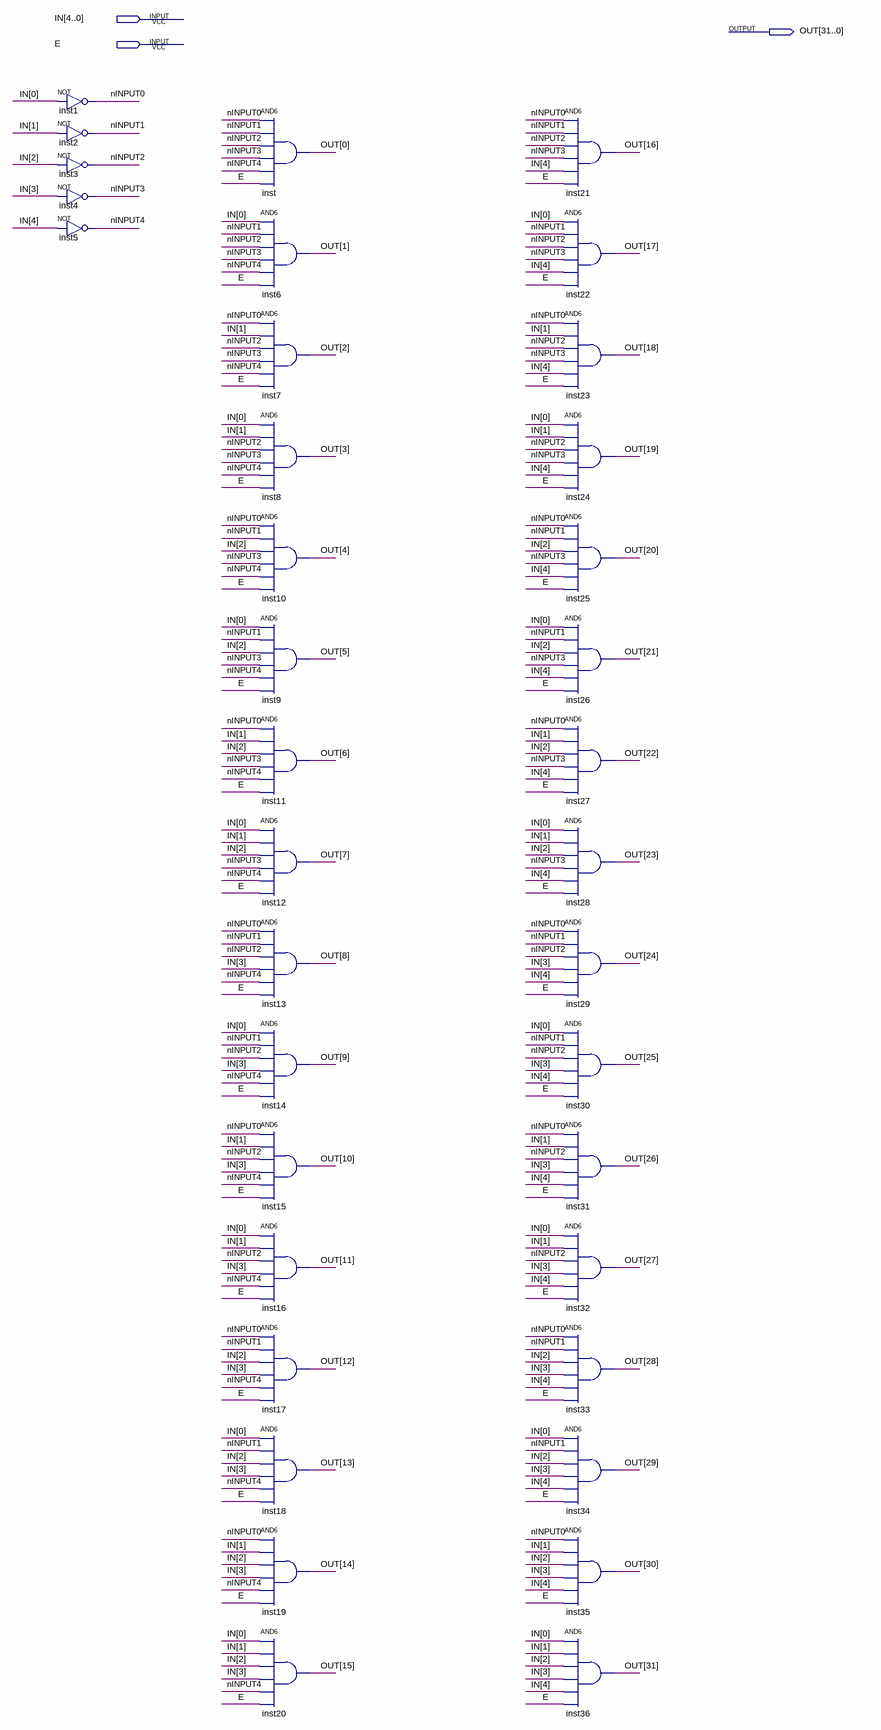
[diagram p0: schematic sheet]
// Quartus schematic DEC5.bdf as structural Verilog: 37 symbols, 3 pins
module DEC5 (
  input  [4:0] IN,
  input  E,
  output [31:0] OUT
);

  wire nINPUT0, nINPUT1, nINPUT2, nINPUT3, nINPUT4;

  not inst1 (nINPUT0, IN[0]);
  not inst2 (nINPUT1, IN[1]);
  not inst3 (nINPUT2, IN[2]);
  not inst4 (nINPUT3, IN[3]);
  not inst5 (nINPUT4, IN[4]);
  and inst (OUT[0], nINPUT0, nINPUT1, nINPUT2, nINPUT3, nINPUT4, E);
  and inst6 (OUT[1], IN[0], nINPUT1, nINPUT2, nINPUT3, nINPUT4, E);
  and inst7 (OUT[2], nINPUT0, IN[1], nINPUT2, nINPUT3, nINPUT4, E);
  and inst8 (OUT[3], IN[0], IN[1], nINPUT2, nINPUT3, nINPUT4, E);
  and inst10 (OUT[4], nINPUT0, nINPUT1, IN[2], nINPUT3, nINPUT4, E);
  and inst9 (OUT[5], IN[0], nINPUT1, IN[2], nINPUT3, nINPUT4, E);
  and inst11 (OUT[6], nINPUT0, IN[1], IN[2], nINPUT3, nINPUT4, E);
  and inst12 (OUT[7], IN[0], IN[1], IN[2], nINPUT3, nINPUT4, E);
  and inst13 (OUT[8], nINPUT0, nINPUT1, nINPUT2, IN[3], nINPUT4, E);
  and inst14 (OUT[9], IN[0], nINPUT1, nINPUT2, IN[3], nINPUT4, E);
  and inst15 (OUT[10], nINPUT0, IN[1], nINPUT2, IN[3], nINPUT4, E);
  and inst16 (OUT[11], IN[0], IN[1], nINPUT2, IN[3], nINPUT4, E);
  and inst17 (OUT[12], nINPUT0, nINPUT1, IN[2], IN[3], nINPUT4, E);
  and inst18 (OUT[13], IN[0], nINPUT1, IN[2], IN[3], nINPUT4, E);
  and inst19 (OUT[14], nINPUT0, IN[1], IN[2], IN[3], nINPUT4, E);
  and inst20 (OUT[15], IN[0], IN[1], IN[2], IN[3], nINPUT4, E);
  and inst21 (OUT[16], nINPUT0, nINPUT1, nINPUT2, nINPUT3, IN[4], E);
  and inst22 (OUT[17], IN[0], nINPUT1, nINPUT2, nINPUT3, IN[4], E);
  and inst23 (OUT[18], nINPUT0, IN[1], nINPUT2, nINPUT3, IN[4], E);
  and inst24 (OUT[19], IN[0], IN[1], nINPUT2, nINPUT3, IN[4], E);
  and inst25 (OUT[20], nINPUT0, nINPUT1, IN[2], nINPUT3, IN[4], E);
  and inst26 (OUT[21], IN[0], nINPUT1, IN[2], nINPUT3, IN[4], E);
  and inst27 (OUT[22], nINPUT0, IN[1], IN[2], nINPUT3, IN[4], E);
  and inst28 (OUT[23], IN[0], IN[1], IN[2], nINPUT3, IN[4], E);
  and inst29 (OUT[24], nINPUT0, nINPUT1, nINPUT2, IN[3], IN[4], E);
  and inst30 (OUT[25], IN[0], nINPUT1, nINPUT2, IN[3], IN[4], E);
  and inst31 (OUT[26], nINPUT0, IN[1], nINPUT2, IN[3], IN[4], E);
  and inst32 (OUT[27], IN[0], IN[1], nINPUT2, IN[3], IN[4], E);
  and inst33 (OUT[28], nINPUT0, nINPUT1, IN[2], IN[3], IN[4], E);
  and inst34 (OUT[29], IN[0], nINPUT1, IN[2], IN[3], IN[4], E);
  and inst35 (OUT[30], nINPUT0, IN[1], IN[2], IN[3], IN[4], E);
  and inst36 (OUT[31], IN[0], IN[1], IN[2], IN[3], IN[4], E);
endmodule
